# EAGLE design PowerPlug (EAGLE 9.6.2)
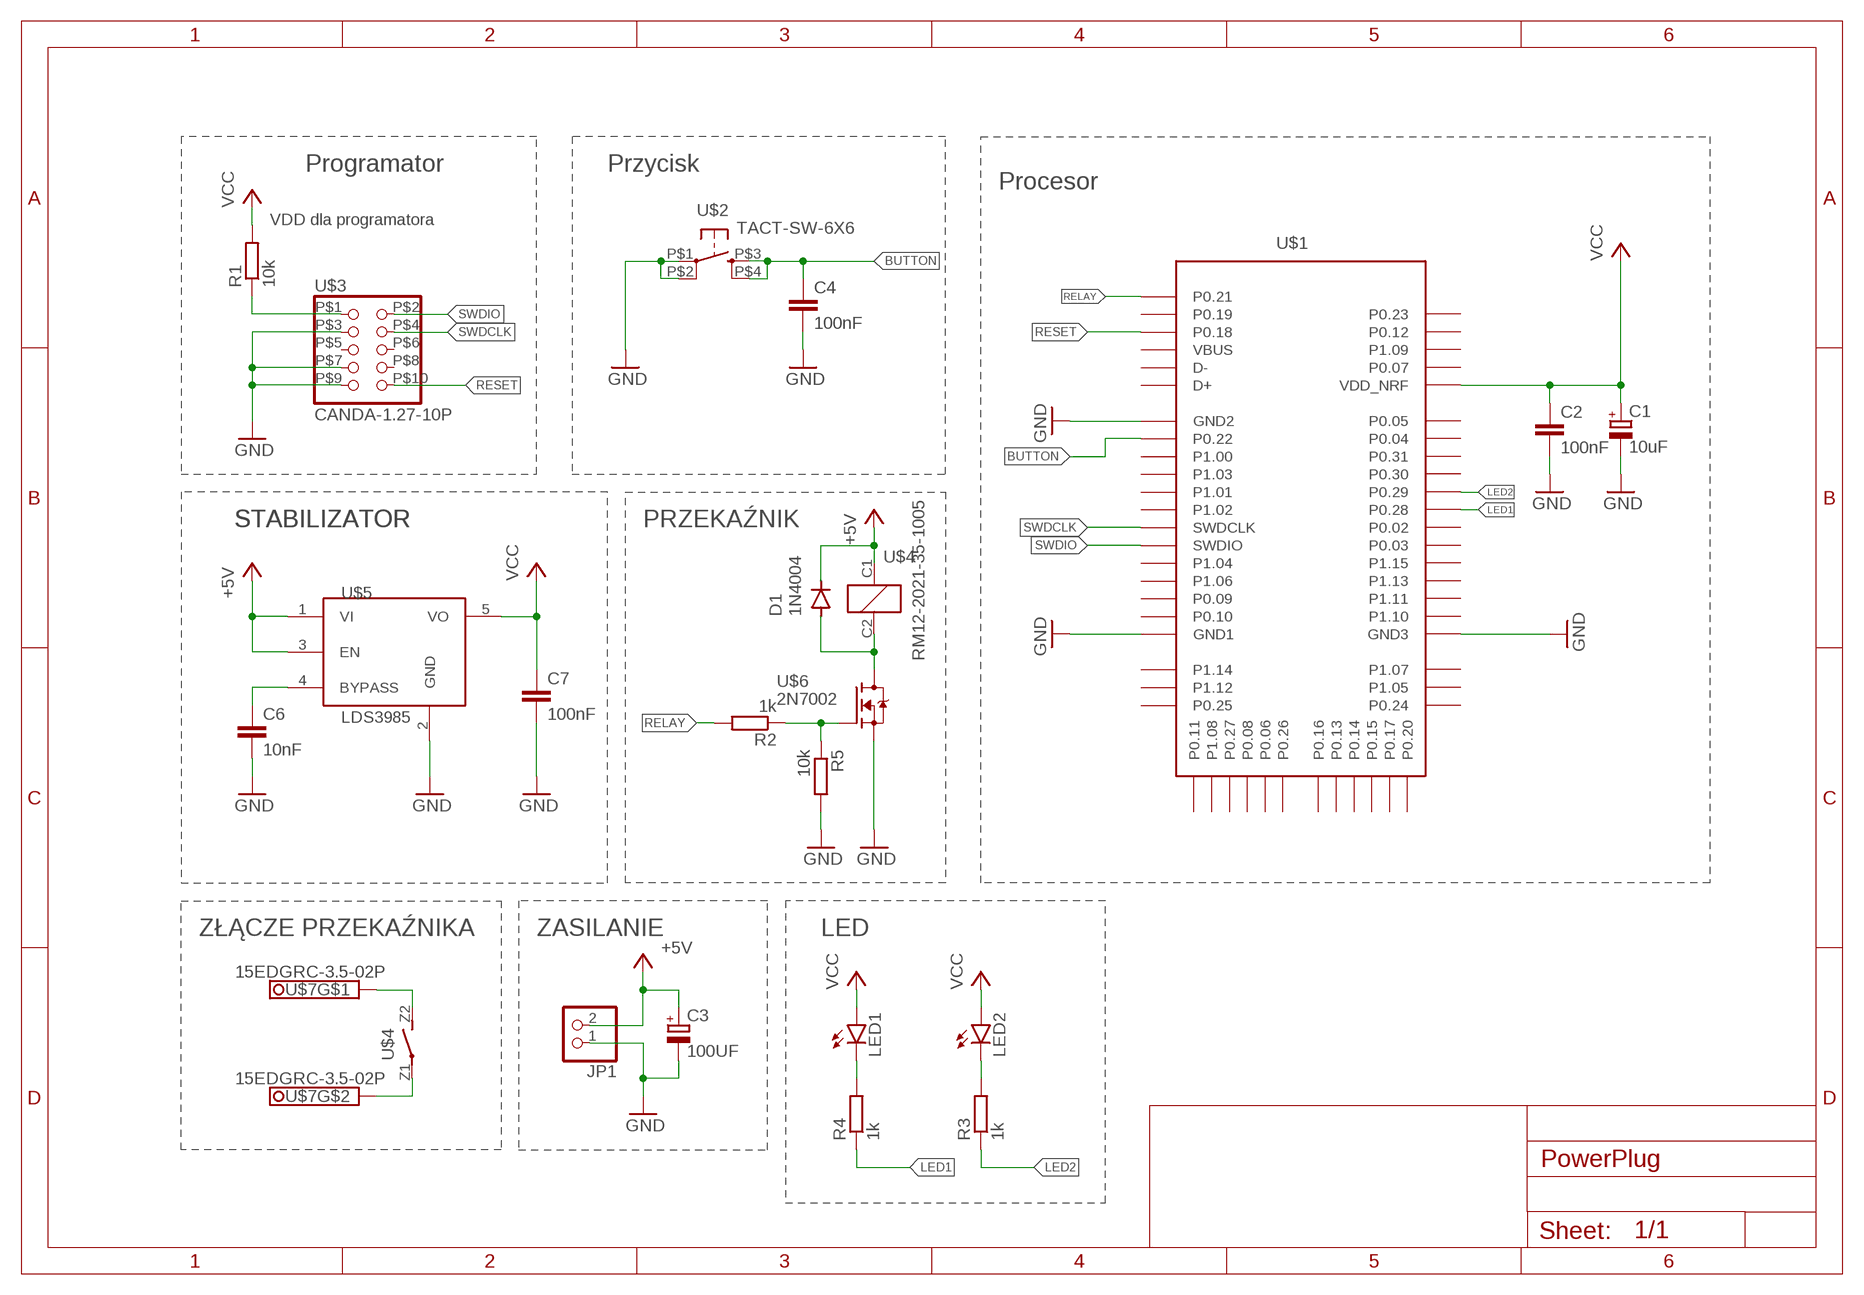
[diagram p0: schematic, sheet 1]

## Parts
C1  10uF  CPOL-EUCT6032  [CT6032]
C2  100nF  C-EUC0805K  [C0805K]
C3  100UF  CPOL-EU153CLV-0605  [153CLV-0605]
C4  100nF  C-EUC0805K  [C0805K]
C6  10nF  C-EUC0805K  [C0805K]
C7  100nF  C-EUC0805K  [C0805K]
D1  1N4004  [DO41-10]
JP1  PINHD-1X2  [1X02]
LED1  LEDCHIPLED_0603  [CHIPLED_0603]
LED2  LEDCHIPLED_0603  [CHIPLED_0603]
R1  10k  R-EU_R0603  [R0603]
R2  1k  R-EU_R0603  [R0603]
R3  1k  R-EU_R0603  [R0603]
R4  1k  R-EU_R0603  [R0603]
R5  10k  R-EU_R0603  [R0603]
U$1  HOLYIOT_18010  [PCBCOMPONENT_1]
U$2  TACT-SW-6X6  [6X6-TACT-SWITCH-SMD]
U$3  CANDA-1.27-10P  [CON-1.27-CANDA]
U$4  RM12-2021-35-1005  [RM12-2021-35-1005]
U$5  LDS3985  [SOT23-5]
U$6  2N7002  [SOT23]
U$7  15EDGRC-3.5-02P  [15EDGRC-3.5-02P]

## Nets
+5V: C3.+ D1.C JP1.2 U$4.C1 U$5.1(VI) U$5.3(EN)
BUTTON: C4.1 U$1.P0.22 U$2.P$3(S) U$2.P$4(S1)
GND: C1.- C2.2 C3.- C4.2 C6.2 C7.2 JP1.1 R5.2 U$1.GND1(GND2) U$1.GND2(GND3) U$1.GND(GND1) U$2.P$1(P) U$2.P$2(P1) U$3.P$3 U$3.P$7 U$3.P$9 U$5.2(GND) U$6.2(S)
LED1: R4.1 U$1.P0.28
LED2: R3.1 U$1.P0.29
N$1: R1.1 U$3.P$1
N$2: D1.A U$4.C2 U$6.3(D)
N$4: C6.1 U$5.4(BYPASS)
N$5: LED1.C R4.2
N$7: R2.1 R5.1 U$6.1(G)
N$9: U$4.Z2(S) U$7.P$1
N$10: U$4.Z1(P) U$7.P$2
N$11: LED2.C R3.2
RELAY: R2.2 U$1.P0.21
RESET: U$1.P0.18 U$3.P$10
SWDCLK: U$1.SWDCLK U$3.P$4
SWDIO: U$1.SWDIO U$3.P$2
VCC: C1.+ C2.1 C7.1 LED1.A LED2.A R1.2 U$1.VDD_NRF U$5.5(VO)
Unconnected: U$1.D+ U$1.D- U$1.P0.02 U$1.P0.03 U$1.P0.04 U$1.P0.05 U$1.P0.06 U$1.P0.07 U$1.P0.08 U$1.P0.09 U$1.P0.10 U$1.P0.11 U$1.P0.12 U$1.P0.13 U$1.P0.14 U$1.P0.15 U$1.P0.16 U$1.P0.17 U$1.P0.19 U$1.P0.20 U$1.P0.23 U$1.P0.24 U$1.P0.25 U$1.P0.26 U$1.P0.27 U$1.P0.30 U$1.P0.31 U$1.P1.00 U$1.P1.01 U$1.P1.02 U$1.P1.03 U$1.P1.04 U$1.P1.05 U$1.P1.06 U$1.P1.07 U$1.P1.08 U$1.P1.09 U$1.P1.10 U$1.P1.11 U$1.P1.12 U$1.P1.13 U$1.P1.14 U$1.P1.15 U$1.VBUS U$3.P$5 U$3.P$6 U$3.P$8

## Notes on the sheet
- Programator | Przycisk
- Procesor
- VDD dla programatora
- STABILIZATOR | STABILIZATOR | PRZEKAŹNIK
- ZŁĄCZE PRZEKAŹNIKA | ZASILANIE | LED

## Library data of the parts
C1 C3 = rcl:CPOL-EU: POLARIZED CAPACITOR, European symbol; SPICEPREFIX: C
C2 C4 C6 C7 = rcl:C-EU: CAPACITOR, European symbol; SPICEPREFIX: C
D1 = Inrzynierka:1N4004: DIODE general purpose rectifier, 1 A
JP1 = Inrzynierka:PINHD-1X2: PIN HEADER
LED1 LED2 = Inrzynierka:LED: LED OSRAM: - CHIPLED LG R971, LG N971, LY N971, LG Q971, LY Q971, LO R971, LY R971 LH N974, LH R974 LS Q976, LO Q976, LY Q976 LO Q996 - Hyper CHIPLED LW Q18S LB Q993, LB Q99A, LB R99A - SideLED LS A670, LO A670, LY A670, LG A670, LP A670 LB A673, LV A673, LT A673, LW A673 LH A674 LY A675 LS A676, LA A676, LO A676, LY A676, LW A676 LS A679, LY A679, LG A679 - Hyper Micro SIDELED® LS Y876, LA Y876, LO Y876, LY Y876 LT Y87S - SmartLED LW L88C, LW L88S LB L89C, LB L89S, LG L890 LS L89K, LO L89K, LY L89K LS L896, LA L896, LO L896, LY L896 - TOPLED LS T670, LO T670, LY T670, LG T670, LP T670 LSG T670, LSP T670, LSY T670, LOP T670, LYG T670 LG T671, LOG T671, LSG T671 LB T673, LV T673, LT T673, LW T673 LH T674 LS T676, LA T676, LO T676, LY T676, LB T676, LH T676, LSB T676, LW T676 LB T67C, LV T67C, LT T67C, LS T67K, LO T67K, LY T67K, LW E67C LS E67B, LA E67B, LO E67B, LY E67B, LB E67C, LV E67C, LT E67C LW T67C LS T679, LY T679, LG T679 LS T770, LO T770, LY T770, LG T770, LP T770 LB T773, LV T773, LT T773, LW T773 LH T774 LS E675, LA E675, LY E675, LS T675 LS T776, LA T776, LO T776, LY T776, LB T776 LHGB T686 LT T68C, LB T68C - Hyper Mini TOPLED® LB M676 - Mini TOPLED Santana® LG M470 LS M47K, LO M47K, LY M47K Source: http://www.osram.convergy.de LUXEON: - LUMILED® LXK2-PW12-R00, LXK2-PW12-S00, LXK2-PW14-U00, LXK2-PW14-V00 LXK2-PM12-R00, LXK2-PM12-S00, LXK2-PM14-U00 LXK2-PE12-Q00, LXK2-PE12-R00, LXK2-PE12-S00, LXK2-PE14-T00, LXK2-PE14-U00 LXK2-PB12-K00, LXK2-PB12-L00, LXK2-PB12-M00, LXK2-PB14-N00, LXK2-PB14-P00, LXK2-PB14-Q00 LXK2-PR12-L00, LXK2-PR12-M00, LXK2-PR14-Q00, LXK2-PR14-R00 LXK2-PD12-Q00, LXK2-PD12-R00, LXK2-PD12-S00 LXK2-PH12-R00, LXK2-PH12-S00 LXK2-PL12-P00, LXK2-PL12-Q00, LXK2-PL12-R00 Source: www.luxeon.com KINGBRIGHT: KA-3528ASYC Source: www.kingbright.com
R1-R5 = rcl:R-EU_: RESISTOR, European symbol; SPICEPREFIX: R
U$1 = Inrzynierka:HOLYIOT_18010
U$2 = Inrzynierka:TACT-SW-6X6
U$3 = Inrzynierka:CANDA-1.27-10P
U$4 = Inrzynierka:RM12-2021-35-1005
U$5 = Inrzynierka:LDS3985
U$6 = Inrzynierka:2N7002
U$7 = Inrzynierka:15EDGRC-3.5-02P

## Board
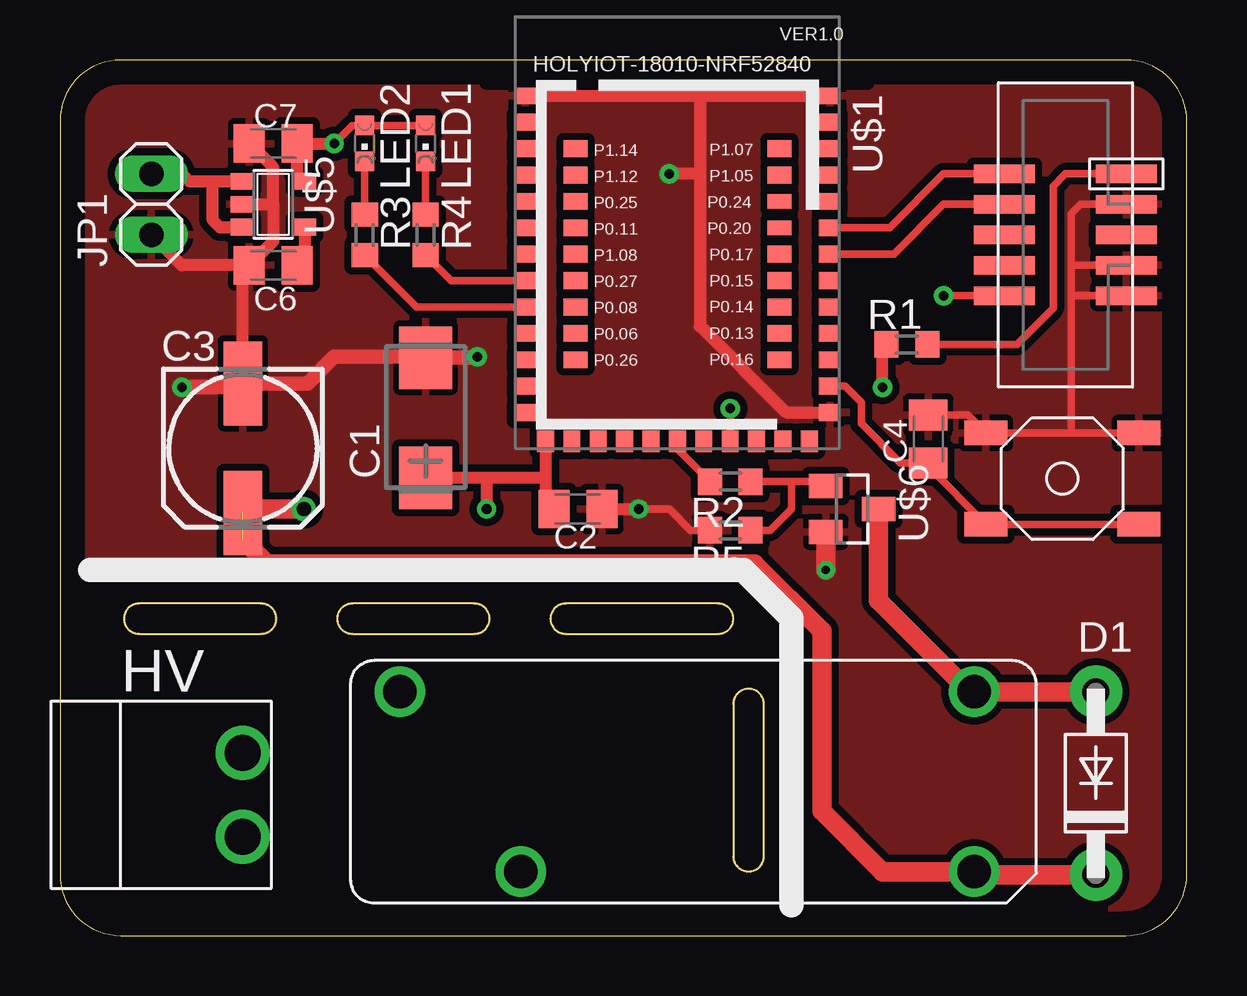
[diagram p1: board, top side]
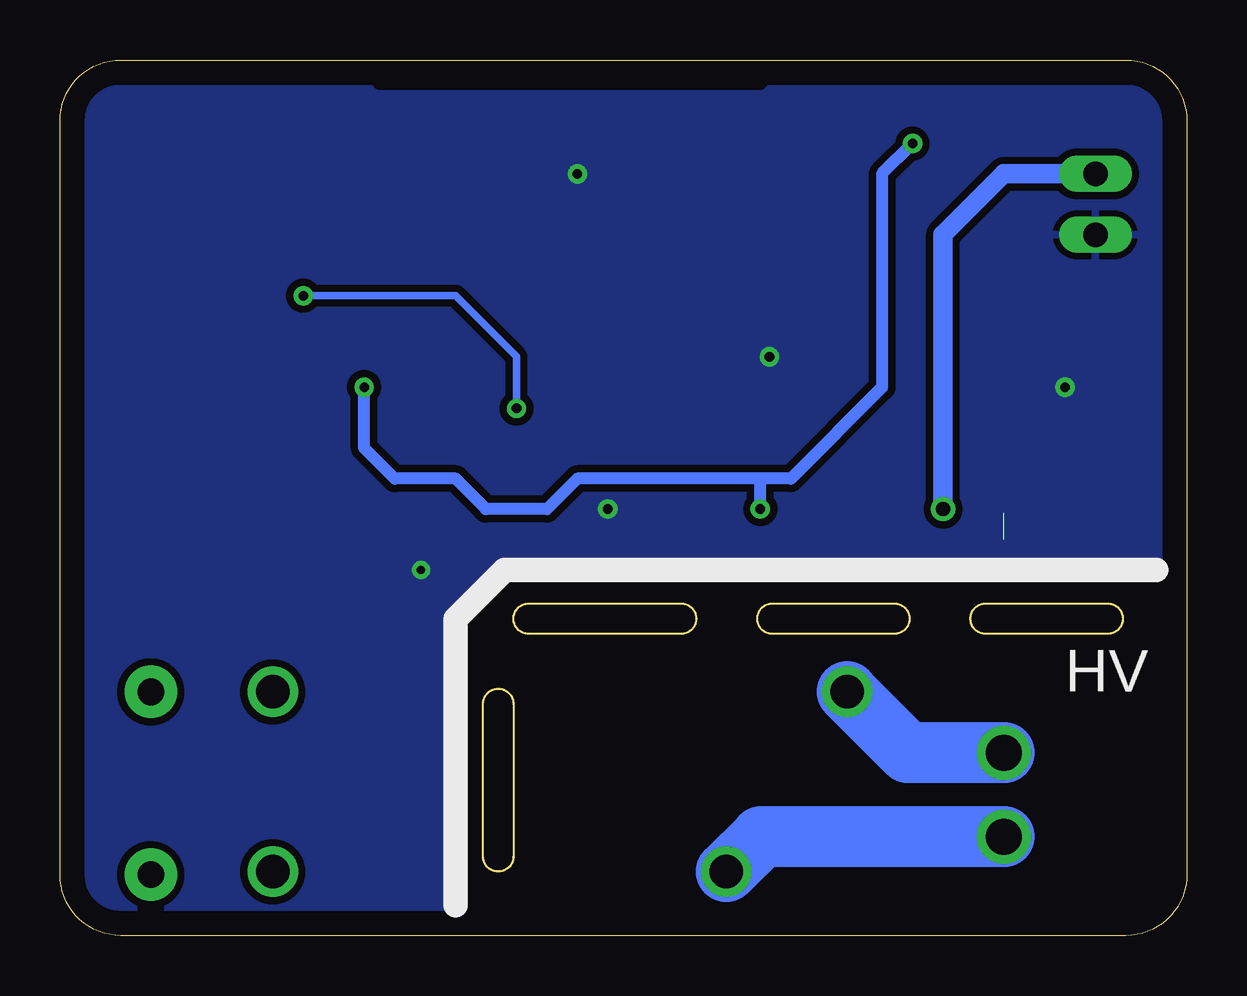
[diagram p2: board, bottom side, seen from below]

Size 46.97 x 36.5 mm. Coordinates in mm from the lower left corner, seen from the top.
Outline: 0,33.96 0,2.54 arc90 2.54,0 44.43,0 arc90 46.97,2.54 46.97,33.96 arc90 44.43,36.5 2.54,36.5 arc90 0,33.96
Outline: 9.02,13.21 arc90 8.38,13.84 3.3,13.84 arc90 2.67,13.21 arc90 3.3,12.57 8.38,12.57 arc90 9.02,13.21
Outline: 17.91,13.21 arc90 17.27,13.84 12.19,13.84 arc90 11.56,13.21 arc90 12.19,12.57 17.27,12.57 arc90 17.91,13.21
Outline: 28.07,13.21 arc90 27.43,13.84 21.08,13.84 arc90 20.45,13.21 arc90 21.08,12.57 27.43,12.57 arc90 28.07,13.21
Outline: 28.7,10.29 arc90 28.07,9.65 28.07,3.3 arc90 28.7,2.67 arc90 29.34,3.3 29.34,9.65 arc90 28.7,10.29
Copper layers (1*16): Top 0.035mm / dielectric 1.5mm / Bottom 0.035mm
Design rules "default": minimum track width 6mil, minimum drill 0.35mm, track to track 6mil, track to pad 6mil, pad to pad 6mil, via to via 6mil, smd to smd 6mil, copper to edge 40mil, drill to drill 6mil, minimum pad ring 10mil, minimum via ring 8mil, stop-mask expansion 4mil, vias tented up to drill 0mil, thermal gap 10mil
tKeepout: area 0,0 to 29.2,14
bKeepout: area 0,0 to 29.2,14

### Footprints (pad centres in the part's own frame; a part is rotated, then mirrored left to right if it is on the bottom)
CT6032 = smd 2.6 x 2.2: + -2.5,0; - 2.5,0
C0805K = smd 1.3 x 1.6: 1 -1,0; 2 1,0
153CLV-0605 = smd 3.5 x 1.6: + 2.7,0; - -2.7,0
DO41-10 = drill 1.118 pad 2.184: A 3.81,0; C -3.81,0
1X02 = drill 1.016 long: 1 -1.27,0; 2 1.27,0
CHIPLED_0603 = smd 0.8 x 0.8: A 0,-0.75; C 0,0.75
R0603 = smd 1 x 1.1: 1 -0.85,0; 2 0.85,0
PCBCOMPONENT_1 = smd 0.7 x 0.9: D+ 5.837,-7.336; D- 4.737,-7.336; P0.07 -4.063,-7.336; P0.12 -1.863,-7.336; P0.18 2.537,-7.336; P0.19 1.437,-7.336; P0.21 0.337,-7.336; P0.23 -0.763,-7.336; P1.09 -2.963,-7.336; VBUS 3.637,-7.336; VDD_NRF -5.163,-7.336 | smd 0.9 x 0.7: GND -6.013,7.064; GND1 6.687,-6.136; GND2 6.687,7.064; P0.02 -6.013,0.464; P0.03 -6.013,1.564; P0.04 -6.013,-5.036; P0.05 -6.013,-6.136; P0.09 6.687,4.864; P0.10 6.687,5.964; P0.22 6.687,-5.036; P0.28 -6.013,-0.636; P0.29 -6.013,-1.736; P0.30 -6.013,-2.836; P0.31 -6.013,-3.936; P1.00 6.687,-3.936; P1.01 6.687,-1.736; P1.02 6.687,-0.636; P1.03 6.687,-2.836; P1.04 6.687,2.664; P1.06 6.687,3.764; P1.10 -6.013,4.864; P1.11 -6.013,5.964; P1.13 -6.013,3.764; P1.15 -6.013,2.664; SWDCLK 6.687,0.464; SWDIO 6.687,1.564 | smd 1 x 0.7: P0.06 -3.913,-2.836; P0.08 -3.913,-1.736; P0.11 -3.913,1.564; P0.13 4.587,-2.836; P0.14 4.587,-1.736; P0.15 4.587,-0.636; P0.16 4.587,-3.936; P0.17 4.587,0.464; P0.25 -3.913,2.664; P0.26 -3.913,-3.936; P0.27 -3.913,-0.636; P1.05 4.587,3.764; P1.07 4.587,4.864; P1.08 -3.913,0.464; P1.12 -3.913,3.764; P1.14 -3.913,4.864 | smd 1 x 0.6: P0.20 4.587,1.564; P0.24 4.587,2.664
6X6-TACT-SWITCH-SMD = smd 1.778 x 1.016: P$1 -3.188,-1.905; P$2 3.188,-1.905; P$3 -3.188,1.905; P$4 3.188,1.905
CON-1.27-CANDA = smd 0.762 x 2.54: P$1 2.54,-2.54; P$2 2.54,2.54; P$3 1.27,-2.54; P$4 1.27,2.54; P$5 0,-2.54; P$6 0,2.54; P$7 -1.27,-2.54; P$8 -1.27,2.54; P$9 -2.54,-2.54; P$10 -2.54,2.54
RM12-2021-35-1005 = drill 1.4: C1 0,7.5; C2 0,0; Z1 18.9,7.5; Z2 23.94,0
SOT23-5 = smd 0.69 x 0.99: 1 -0.95,-1.29; 2 0,-1.29; 3 0.95,-1.29; 4 0.95,1.3; 5 -0.95,1.3
SOT23 = smd 1 x 1.4: 1 -0.95,-1.1; 2 0.95,-1.1; 3 0,1.1
15EDGRC-3.5-02P = drill 1.5: P$1 0,0; P$2 0,3.5

### Placement (x,y rotation side)
C1  15.24,21.59 90 top
C2  21.59,17.78 0 top
C3  7.62,20.32 270 top
C4  36.2,20.7 90 top
C6  8.89,27.94 180 top
C7  8.89,33.02 180 top
D1  43.18,6.35 90 top
JP1  3.81,30.48 90 top
LED1  15.24,33.02 180 top
LED2  12.7,33.02 180 top
R1  35.31,24.64 180 top
R2  27.94,18.92 180 top
R3  12.7,29.21 90 top
R4  15.24,29.21 90 top
R5  27.94,16.89 180 top
U$1  25.4,27.94 0 top
U$2  41.78,19.05 180 top
U$3  41.91,29.21 90 top
U$4  38.1,10.16 180 top
U$5  8.89,30.48 270 top
U$6  33.02,17.78 270 top
U$7  7.62,7.62 180 top

### Tracks (layer width: path | path; a pad name or v marks a point on that pad's centre or on a via)
+5V  (via drill 0.6)  (1 unrouted)
  Top 0.508: U$5.1 6.35,31.43 | 6.35,31.43 5.4,31.43 5.08,31.75 JP1.2 | U$5.3 6.67,29.53 6.35,29.84 6.35,31.43
  Top 0.813: D1.C 38.22,2.54 U$4.C1 34.29,2.66 31.75,5.2 31.75,12.7 28.96,15.49 8.64,15.49 7.62,16.51 | C3.+ 7.78,17.78 v10.16,17.78
  Bottom 0.813: v10.16,17.78 10.16,29.21 7.62,31.75 JP1.2
BUTTON
  Top 0.305: U$2.P$3 U$2.P$4 36.2,19.54 C4.1 35.04,19.7 33.4,21.34 33.4,22.22 32.72,22.9 U$1.P0.22
GND  (via drill 0.35, 0.4)
  Top 0.305: U$3.P$3 42.55,30.48 42.16,30.1 42.16,27.94 | 42.16,27.94 42.16,26.67 | U$3.P$9 42.16,26.67 | U$3.P$7 42.16,27.94 | U$2.P$1 42.16,20.95 | 42.16,20.95 U$2.P$2 37.85,21.7 C4.2 | 42.16,26.67 42.16,20.95 | R5.2 26.29,16.89 25.4,17.78 v24.13,17.78
  Top 0.508: U$5.2 8.89,30.48 | 8.89,30.48 8.89,31.99 8.83,32.05 8.83,32.08 C7.2 | 8.89,30.48 8.89,28.96 8.83,28.91 8.83,28.88 C6.2 | C6.2 5.08,27.94 JP1.1 | C3.- 7.62,27.67 C6.2 | C2.2 v24.13,17.78 | U$1.GND 26.67,35 | 26.67,35 U$1.GND2 | 26.67,35 26.67,31.75 | 26.67,31.75 26.67,25.4 30.27,21.8 U$1.GND1 | 26.67,31.75 v25.4,31.75
  Top 0.61: v17.4,24.13 17.36,24.09 C1.- 15.2,24.13 11.43,24.13 10.32,23.02 C3.- 7.46,22.86 v5.08,22.86
  Top 0.813: U$6.2 v31.92,15.24
  pour Top (isolate 0.305): -1.27,15.24 27.94,15.24 30.48,12.7 30.48,-1.27 48.26,-1.27 48.26,40.64 -1.27,40.64
  pour Bottom (isolate 0.305): -2.54,15.24 27.94,15.24 30.48,12.7 30.48,-2.54 49.53,-2.54 49.53,41.91 -2.54,41.91
LED1
  Top 0.305: U$1.P0.28 16.3,27.3 R4.1
LED2
  Top 0.305: U$1.P0.29 14.86,26.2 R3.1
N$1
  Top 0.305: U$3.P$1 41.91,31.75 41.4,31.24 41.4,26.16 39.88,24.64 R1.1
N$2
  Top 0.813: D1.A U$4.C2 37.93,10.16 34.12,13.97 U$6.3
N$4
  Top 0.508: U$5.4 10.19,28.24 C6.1
N$5
  Top 0.305: R4.2 LED1.C
N$7
  Top 0.305: R5.1 29.59,16.89 30.48,17.78 30.48,18.92 | U$6.1 31.73,18.92 30.48,18.92 | R2.1 30.48,18.92
N$9
  Bottom 2.54: U$7.P$1 11.62,7.62 U$4.Z2
N$10
  Bottom 2.54: U$7.P$2 17.74,4.12 U$4.Z1
N$11
  Top 0.305: LED2.C R3.2
RELAY
  Top 0.305: R2.2 25.74,20.28 U$1.P0.21
RESET  (via drill 0.4)
  Top 0.305: U$3.P$10 v36.83,26.67 | v27.94,21.97 U$1.P0.18
  Bottom 0.305: v36.83,26.67 30.48,26.67 27.94,24.13 v27.94,21.97
SWDCLK
  Top 0.305: U$1.SWDCLK 34.75,28.4 36.83,30.48 U$3.P$4
SWDIO
  Top 0.305: U$1.SWDIO 34.58,29.5 36.83,31.75 U$3.P$2
VCC  (via drill 0.4)
  Top 0.305: v11.43,33.02 12.18,33.77 LED2.A LED1.A
  Top 0.508: U$5.5 9.89,31.73 C7.1 v11.43,33.02 | v34.29,22.86 34.29,24.47 R1.2 | U$1.VDD_NRF 20.24,19.05 | 20.24,19.05 20.24,18.13 C2.1 | C1.+ 17.78,19.09 | 17.78,19.09 20.2,19.09 20.24,19.05 | 17.78,19.09 v17.78,17.78
  Bottom 0.508: v11.43,33.02 12.7,31.75 12.7,22.86 16.51,19.05 17.78,19.05 | v34.29,22.86 34.29,20.32 33.02,19.05 30.48,19.05 29.21,17.78 26.67,17.78 25.4,19.05 17.78,19.05 | v17.78,17.78 17.78,19.05

### Text on the board
tPlace: HV
bPlace: HV